# Altium schematic sheet 5kW Sensor.SchDoc
size A4; SheetNumber: 9; SheetTotal: 11
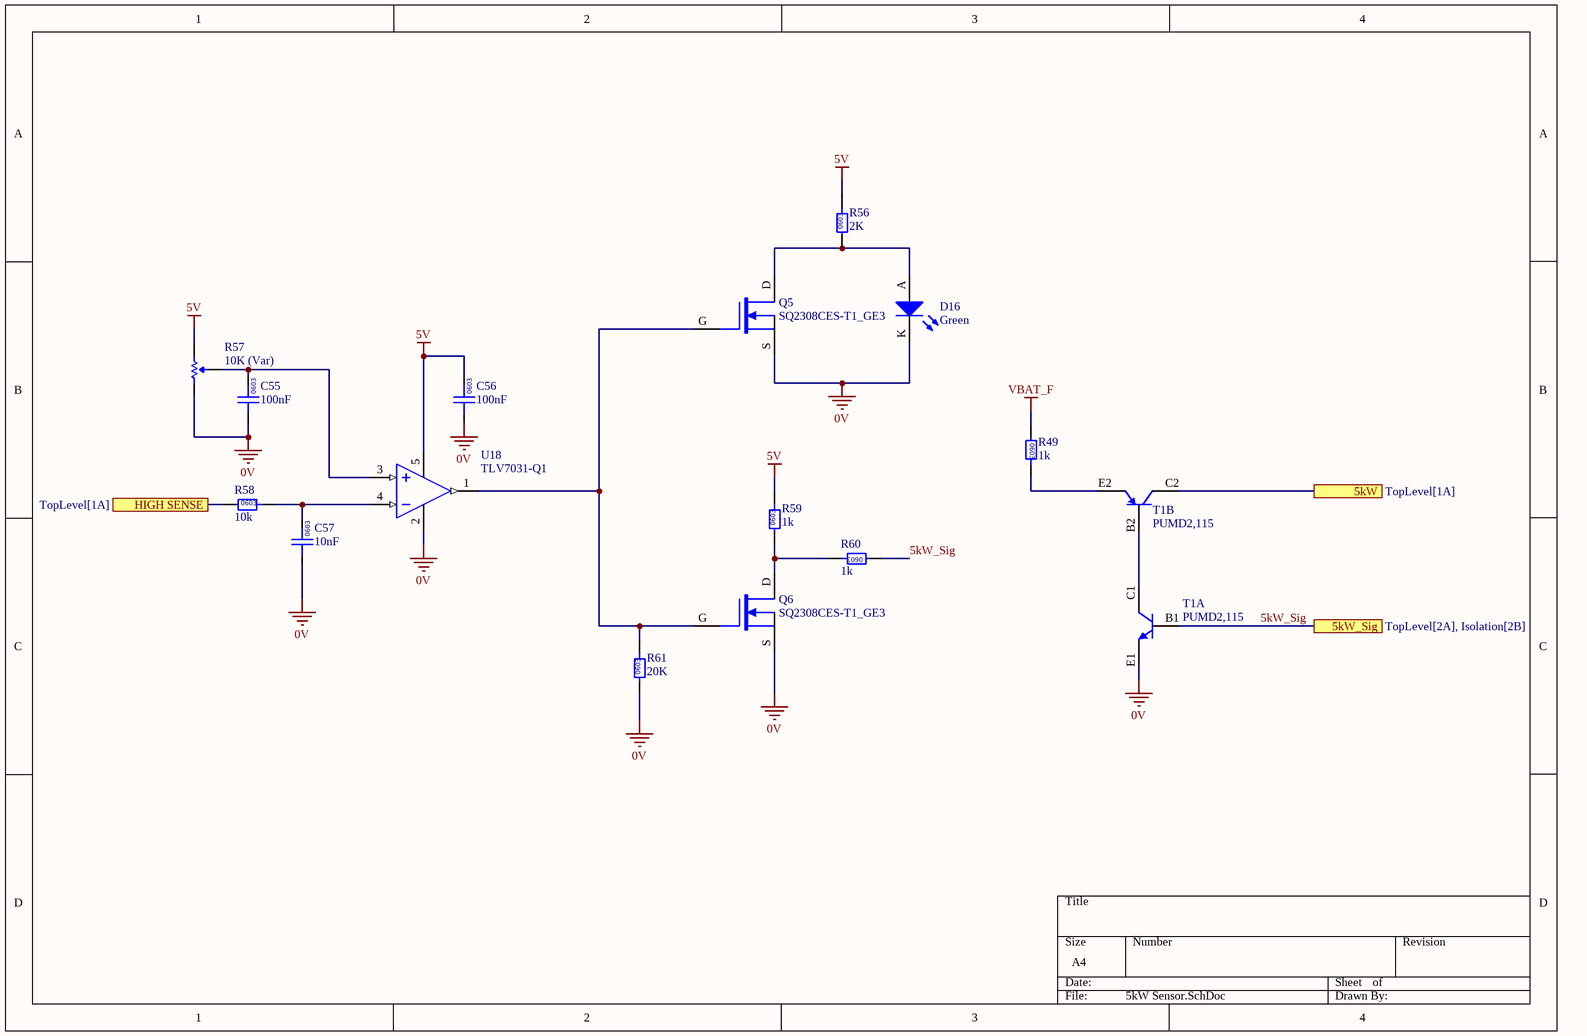
[diagram p0: 5kW Sensor.SchDoc]

## Parts
C55  100nF  [0603]
C56  100nF  [0603]
C57  10nF  [0603]
D16  Green  [0805 LED]
Q5  SQ2308CES-T1_GE3  [VSHY SOT-23-3]
Q6  SQ2308CES-T1_GE3  [VSHY SOT-23-3]
R49  1k  [0603]
R56  2K  [0603]
R57  10K (Var)  [B 3296]
R58  10k  [0603]
R59  1k  [0603]
R60  1k  [0603]
R61  20K  [0603]
T1  PUMD2,115  [NXP, SOT363]  (parts A,B of 2)
U18  TLV7031-Q1  [TI SOT-23-5]

## Ports
5kW (see TopLevel[1A]), 5kW_Sig (see TopLevel[2A], Isolation[2B]), HIGH SENSE (see TopLevel[1A])

## Nets
0V: C55.1 C56.1 C57.1 D16.K Q5.S Q6.S R57.3(CW) R61.1 T1.E1 U18.2(V-)
5V: C56.2 R56.2 R57.1(CCW) R59.2 U18.5(Vcc)
VBAT_F: R49.1
5kW: T1.C2(C) ; port 5kW
5kW_Sig: R60.1 T1.B1 ; port 5kW_Sig
HIGH SENSE: R58.1 ; port HIGH SENSE
NetC55_2: C55.2 R57.2(Wiper) U18.3(IN+)
NetC57_2: C57.2 R58.2 U18.4(IN-)
NetD16_A: D16.A Q5.D R56.1
NetQ5_G: Q5.G Q6.G R61.2 U18.1(OUT)
NetQ6_D: Q6.D R59.1 R60.2
NetR49_2: R49.2 T1.E2(E)
NetT1_B2: T1.B2 T1.C1

## Notes on the sheet
- (in symbol GCM188L81H103KA03D) 0603
- (in symbol GCM188L81H104KA57D) 0603
- (in symbol RC0603FR-071KL) 0603
- (in symbol RC0603FR-072KL) 0603
- (in symbol RC0603FR-0710KL) 0603
- (in symbol RC0603FR-0720KL) 0603

## Library data of the parts
C55 C56 = GCM188L81H104KA57D: Manufacturer: muRata; Rated Voltage: 50V; Tolerance: ±10%; Material: MLCC; Temperature Rating: X8L; Part Number: GCM188L81H104KA57D; Value: 100nF; Digikey Part Number: 490-6049-1-ND
C57 = GCM188L81H103KA03D: Manufacturer: muRata; Rated Voltage: 50V; Tolerance: ±10%; Material: MLCC; Temperature Rating: X8L; Part Number: GCM188L81H103KA03D; Value: 10nF; Digikey Part Number: 490-GCM188L81H103KA03DCT-ND
D16 = SML-210FTT86: Green LED Indication - Discrete 1.75V 0805 (2012 Metric); Manufacturer: ROHM Semiconductor; Part Number: SML-210FTT86; Colour: Green; Digikey Part Number: 511-1285-1-ND
Q5 Q6 = SQ2308CES-T1_GE3: MOSFET N-CH 60V 2.3A SOT23; Manufacturer: Vishay Siliconix; Type: N-channel; Rated Power: 2W; Published: 24-Mar-1999; LatestRevisionDate: 29-May-2009; LatestRevisionNote: IPC-7351 Footprint Added.; PackageVersion: Sep-2000; PackageReference: SOT-343; Publisher: Altium Limited; PackageDescription: 4-Pin SOT-343 Package 1.3 mm Pitch, 2.1 mm Lead Span; Part Number: SQ2308CES-T1_GE3; Digikey Part Number: SQ2308CES-T1_GE3CT-ND
R49 R59 R60 = RC0603FR-071KL: Manufacturer: YAGEO; Tolerance: 0.01; Rated Power: 0.1W; Part Number: RC0603FR-071KL; Value: 1k; Material: FR-07; Digikey Part Number: 311-1.00KHRCT-ND
R56 = RC0603FR-072KL: Manufacturer: YAGEO; Tolerance: 0.01; Rated Power: 0.1W; Part Number: RC0603FR-072KL; Value: 2K; Material: FR-07; Digikey Part Number: 311-2.00KHRCT-ND
R57 = 3296W-1-103LF: Manufacturer: Bournes Inc; Tolerance: 0.1; Rated Power: 0.5W; Part Number: 3296W-1-103LF; Value: 10K (Var); Digikey Part Number: 3296W-103LF-ND
R58 = RC0603FR-0710KL: Manufacturer: YAGEO; Tolerance: 0.01; Rated Power: 0.1W; Part Number: RC0603FR-0710KL; Value: 10k; Material: FR-07; Digikey Part Number: 311-10.0KHRCT-ND
R61 = RC0603FR-0720KL: Manufacturer: YAGEO; Tolerance: 0.01; Rated Power: 0.1W; Part Number: RC0603FR-0720KL; Value: 20K; Material: FR-07; Digikey Part Number: 311-20.0KHRCT-ND
T1 = CMP-013-00000-1: Small Signal Bipolar Transistor, 0.1A I(C), 50V V(BR)CEO, 2-Element, NPN and PNP, Silicon; Transistor Application: SWITCHING; Number of Elements: 2; Reference Standard: IEC-60134; Polarity/Channel Type: NPN,PNP; Max Collector Current: 100mA; Package Body Material: Plastic; Time @ Peak Reflow Temperature-Max (s): 30s; DC Current Gain-Min (hFE): 60; Transistor Element Material: SILICON; Reach SVHC Compliant: Yes; JESD-30 Code: R-PDSO-G6; Peak Reflow Temperature (Cel): 260°C; JESD-609 Code: e3; RoHS Compliant: Yes; Package Shape: Rectangular; Surface Mount: Yes; Terminal Finish: Tin; Terminal Form: Gull Wing; Terminal Position: DUAL; Pins: 6; Moisture Sensitivity Level: 1; Collector-emitter Voltage-Max: 50V; Package Style: SMALL OUTLINEMeter
U18 = TLV7031-Q1: Manufacturer: Texas Instruments; Input Voltage: 1.6 to 6.5 V; Channels: 1; Output: Push-Pull; Part Number: TLV7031-Q1; Digikey Part Number: 296-TLV7031QDBVRQ1CT-ND